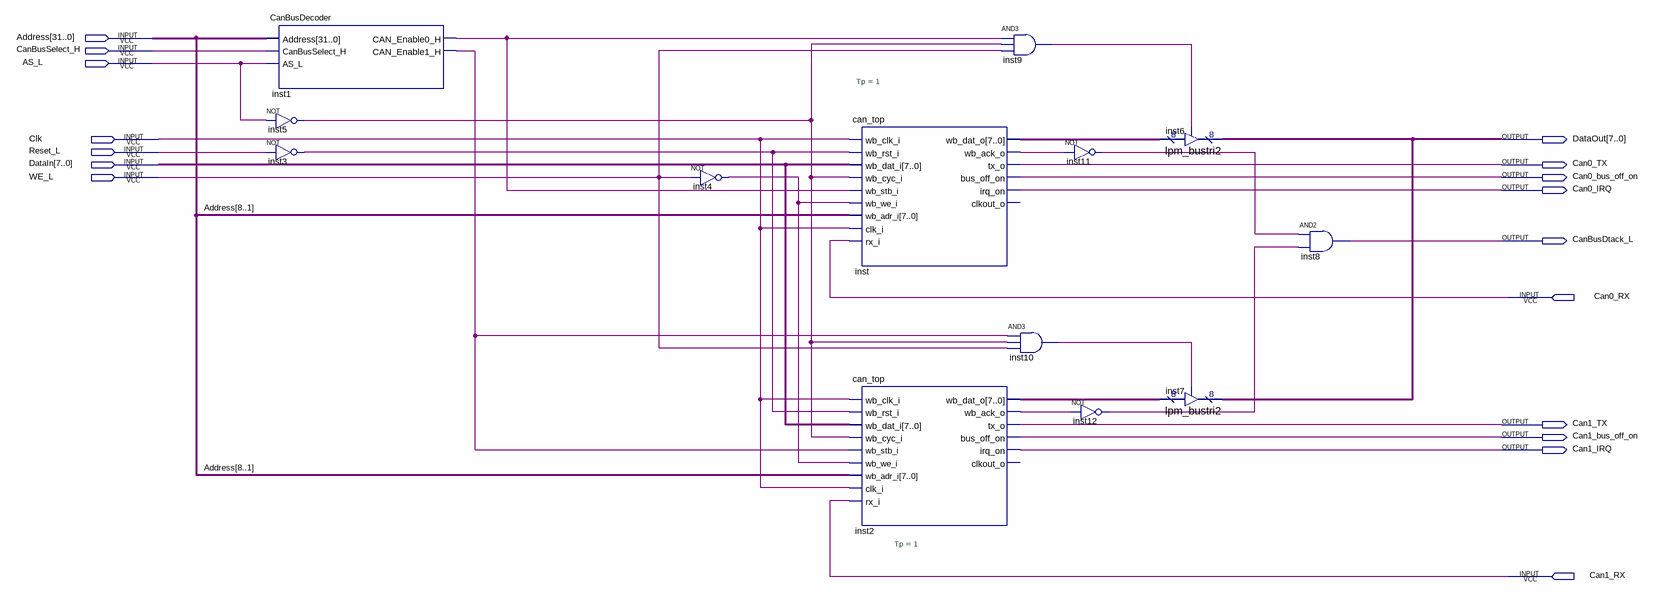
[diagram p0: schematic sheet]
// Quartus schematic CanBus.bdf as structural Verilog: 13 symbols, 17 pins
module CanBus (
  input  [31:0] Address,
  input  CanBusSelect_H,
  input  AS_L,
  input  Clk,
  input  Reset_L,
  input  [7:0] DataIn,
  input  WE_L,
  input  Can0_RX,
  input  Can1_RX,
  output [7:0] DataOut,
  output Can0_TX,
  output Can0_bus_off_on,
  output Can0_IRQ,
  output CanBusDtack_L,
  output Can1_TX,
  output Can1_bus_off_on,
  output Can1_IRQ
);

  wire inst1_can_enable0_h, inst1_can_enable1_h, inst2_wb_ack_o, inst3_out, inst4_out, inst5_out, inst9_out,
       inst10_out, inst11_out, inst12_out, inst_wb_ack_o;
  wire [7:0] inst2_wb_dat_o, inst_wb_dat_o;

  CanBusDecoder inst1 (
    .Address(Address), .CanBusSelect_H(CanBusSelect_H), .AS_L(AS_L), .CAN_Enable0_H(inst1_can_enable0_h),
    .CAN_Enable1_H(inst1_can_enable1_h));
  not inst5 (inst5_out, AS_L);
  not inst3 (inst3_out, Reset_L);
  not inst4 (inst4_out, WE_L);
  can_top #(.Tp(1)) inst (
    .wb_clk_i(Clk), .wb_rst_i(inst3_out), .wb_dat_i(DataIn), .wb_cyc_i(inst5_out),
    .wb_stb_i(inst1_can_enable0_h), .wb_we_i(inst4_out), .wb_adr_i(Address[8:1]), .clk_i(Clk),
    .rx_i(Can0_RX), .wb_dat_o(inst_wb_dat_o), .wb_ack_o(inst_wb_ack_o), .tx_o(Can0_TX),
    .bus_off_on(Can0_bus_off_on), .irq_on(Can0_IRQ));  // open: clkout_o
  can_top #(.Tp(1)) inst2 (
    .wb_clk_i(Clk), .wb_rst_i(inst3_out), .wb_dat_i(DataIn), .wb_cyc_i(inst5_out),
    .wb_stb_i(inst1_can_enable1_h), .wb_we_i(inst4_out), .wb_adr_i(Address[8:1]), .clk_i(Clk),
    .rx_i(Can1_RX), .wb_dat_o(inst2_wb_dat_o), .wb_ack_o(inst2_wb_ack_o), .tx_o(Can1_TX),
    .bus_off_on(Can1_bus_off_on), .irq_on(Can1_IRQ));  // open: clkout_o
  and inst9 (inst9_out, inst1_can_enable0_h, inst5_out, WE_L);
  and inst10 (inst10_out, inst1_can_enable1_h, inst5_out, WE_L);
  not inst11 (inst11_out, inst_wb_ack_o);
  not inst12 (inst12_out, inst2_wb_ack_o);
  lpm_bustri2 inst6 (.enabledt(inst9_out), .data(inst_wb_dat_o), .tridata(DataOut));
  lpm_bustri2 inst7 (.enabledt(inst10_out), .data(inst2_wb_dat_o), .tridata(DataOut));
  and inst8 (CanBusDtack_L, inst11_out, inst12_out);
endmodule
